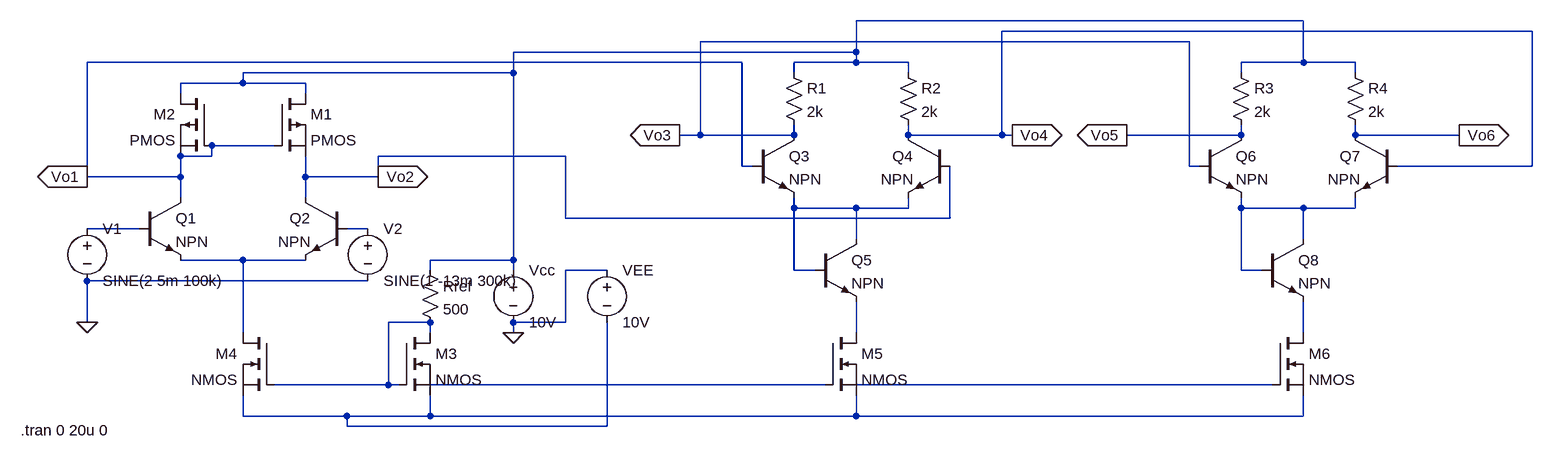
[diagram p0: schematic par_diferencial_3_andares.asc]
par_diferencial_3_andares.asc, the LTspice schematic file:
Version 4
SHEET 1 2244 680
WIRE 1888 -192 1200 -192
WIRE 2240 -176 1424 -176
WIRE 1712 -160 960 -160
WIRE 1200 -144 1200 -192
WIRE 1200 -144 672 -144
WIRE 1024 -128 16 -128
WIRE 1200 -128 1200 -144
WIRE 1200 -128 1104 -128
WIRE 1280 -128 1200 -128
WIRE 1888 -128 1888 -192
WIRE 1888 -128 1792 -128
WIRE 1968 -128 1888 -128
WIRE 672 -112 672 -144
WIRE 672 -112 256 -112
WIRE 1104 -112 1104 -128
WIRE 1280 -112 1280 -128
WIRE 1792 -112 1792 -128
WIRE 1968 -112 1968 -128
WIRE 256 -96 256 -112
WIRE 256 -96 160 -96
WIRE 352 -96 256 -96
WIRE 160 -80 160 -96
WIRE 352 -80 352 -96
WIRE 960 -16 960 -160
WIRE 960 -16 928 -16
WIRE 1104 -16 1104 -32
WIRE 1104 -16 960 -16
WIRE 1280 -16 1280 -32
WIRE 1424 -16 1424 -176
WIRE 1424 -16 1280 -16
WIRE 1440 -16 1424 -16
WIRE 1792 -16 1792 -32
WIRE 1792 -16 1616 -16
WIRE 1968 -16 1968 -32
WIRE 2128 -16 1968 -16
WIRE 304 0 208 0
WIRE 208 16 208 0
WIRE 208 16 160 16
WIRE 752 16 464 16
WIRE 1024 32 1024 -128
WIRE 1040 32 1024 32
WIRE 1712 32 1712 -160
WIRE 1728 32 1712 32
WIRE 2240 32 2240 -176
WIRE 2240 32 2032 32
WIRE 16 48 16 -128
WIRE 160 48 160 16
WIRE 160 48 16 48
WIRE 352 48 352 16
WIRE 464 48 464 16
WIRE 464 48 352 48
WIRE 160 80 160 48
WIRE 352 80 352 48
WIRE 1104 96 1104 80
WIRE 1200 96 1104 96
WIRE 1280 96 1280 80
WIRE 1280 96 1200 96
WIRE 1792 96 1792 80
WIRE 1888 96 1792 96
WIRE 1968 96 1968 80
WIRE 1968 96 1888 96
WIRE 752 112 752 16
WIRE 1344 112 1344 32
WIRE 1344 112 752 112
WIRE 96 128 16 128
WIRE 448 128 416 128
WIRE 1200 144 1200 96
WIRE 1888 144 1888 96
WIRE 256 176 160 176
WIRE 352 176 256 176
WIRE 672 176 672 -112
WIRE 672 176 544 176
WIRE 544 192 544 176
WIRE 672 192 672 176
WIRE 816 192 752 192
WIRE 1104 192 1104 96
WIRE 1136 192 1104 192
WIRE 1792 192 1792 96
WIRE 1824 192 1792 192
WIRE 448 208 16 208
WIRE 16 272 16 208
WIRE 544 272 480 272
WIRE 752 272 752 192
WIRE 752 272 672 272
WIRE 256 288 256 176
WIRE 544 288 544 272
WIRE 672 288 672 272
WIRE 1200 288 1200 240
WIRE 1888 288 1888 240
WIRE 480 368 480 272
WIRE 480 368 304 368
WIRE 496 368 480 368
WIRE 1152 368 544 368
WIRE 1840 368 1200 368
WIRE 256 416 256 384
WIRE 416 416 256 416
WIRE 544 416 544 384
WIRE 544 416 416 416
WIRE 1200 416 1200 384
WIRE 1200 416 544 416
WIRE 1888 416 1888 384
WIRE 1888 416 1200 416
WIRE 416 432 416 416
WIRE 816 432 816 272
WIRE 816 432 416 432
FLAG 672 288 0
FLAG 16 272 0
FLAG 16 48 Vo1
IOPIN 16 48 Out
FLAG 464 48 Vo2
IOPIN 464 48 Out
FLAG 928 -16 Vo3
IOPIN 928 -16 Out
FLAG 1440 -16 Vo4
IOPIN 1440 -16 Out
FLAG 1616 -16 Vo5
IOPIN 1616 -16 Out
FLAG 2128 -16 Vo6
IOPIN 2128 -16 Out
SYMBOL npn 96 80 R0
SYMATTR InstName Q1
SYMBOL npn 416 80 M0
SYMATTR InstName Q2
SYMBOL res 528 176 R0
SYMATTR InstName Rref
SYMATTR Value 500
SYMBOL voltage 672 176 R0
SYMATTR InstName Vcc
SYMATTR Value 10V
SYMBOL pmos 304 -80 R0
SYMATTR InstName M1
SYMBOL pmos 208 -80 M0
SYMATTR InstName M2
SYMBOL nmos 496 288 R0
SYMATTR InstName M3
SYMBOL nmos 304 288 M0
SYMATTR InstName M4
SYMBOL voltage 816 176 R0
SYMATTR InstName VEE
SYMATTR Value 10V
SYMBOL voltage 16 112 R0
WINDOW 123 0 0 Left 0
WINDOW 39 0 0 Left 0
SYMATTR InstName V1
SYMATTR Value SINE(2 5m 100k)
SYMBOL voltage 448 112 R0
WINDOW 123 0 0 Left 0
WINDOW 39 0 0 Left 0
SYMATTR InstName V2
SYMATTR Value SINE(1 -13m 300k)
SYMBOL nmos 1152 288 R0
SYMATTR InstName M5
SYMBOL npn 1040 -16 R0
SYMATTR InstName Q3
SYMBOL npn 1344 -16 M0
SYMATTR InstName Q4
SYMBOL res 1088 -128 R0
SYMATTR InstName R1
SYMATTR Value 2k
SYMBOL res 1264 -128 R0
SYMATTR InstName R2
SYMATTR Value 2k
SYMBOL npn 1136 144 R0
SYMATTR InstName Q5
SYMBOL nmos 1840 288 R0
SYMATTR InstName M6
SYMBOL npn 1728 -16 R0
SYMATTR InstName Q6
SYMBOL npn 2032 -16 M0
SYMATTR InstName Q7
SYMBOL res 1776 -128 R0
SYMATTR InstName R3
SYMATTR Value 2k
SYMBOL res 1952 -128 R0
SYMATTR InstName R4
SYMATTR Value 2k
SYMBOL npn 1824 144 R0
SYMATTR InstName Q8
TEXT -86 438 Left 2 !.tran 0 20u 0

The netlist it stands for:
* par_diferencial_3_andares.asc
Q1 Vo1 N004 N006 0 NPN
Q2 Vo2 N005 N006 0 NPN
Rref N001 N007 500
Vcc N001 0 10V
M1 N001 Vo1 Vo2 Vo2 PMOS
M2 N001 Vo1 Vo1 Vo1 PMOS
M3 N007 N007 N012 N012 NMOS
M4 N006 N007 N012 N012 NMOS
VEE 0 N012 10V
V1 N004 0 SINE(2 5m 100k)
V2 N005 0 SINE(1 -13m 300k)
M5 N008 N010 N012 N012 NMOS
Q3 Vo3 Vo1 N002 0 NPN
Q4 Vo4 Vo2 N002 0 NPN
R1 N001 Vo3 2k
R2 N001 Vo4 2k
Q5 N002 N002 N008 0 NPN
M6 N009 N011 N012 N012 NMOS
Q6 Vo5 Vo3 N003 0 NPN
Q7 Vo6 Vo4 N003 0 NPN
R3 N001 Vo5 2k
R4 N001 Vo6 2k
Q8 N003 N003 N009 0 NPN
.model NPN NPN
.model PNP PNP
.lib standard.bjt
.model NMOS NMOS
.model PMOS PMOS
.lib standard.mos
.tran 0 20u 0
.backanno
.end